# EAGLE design untitled (EAGLE 9.4.2)
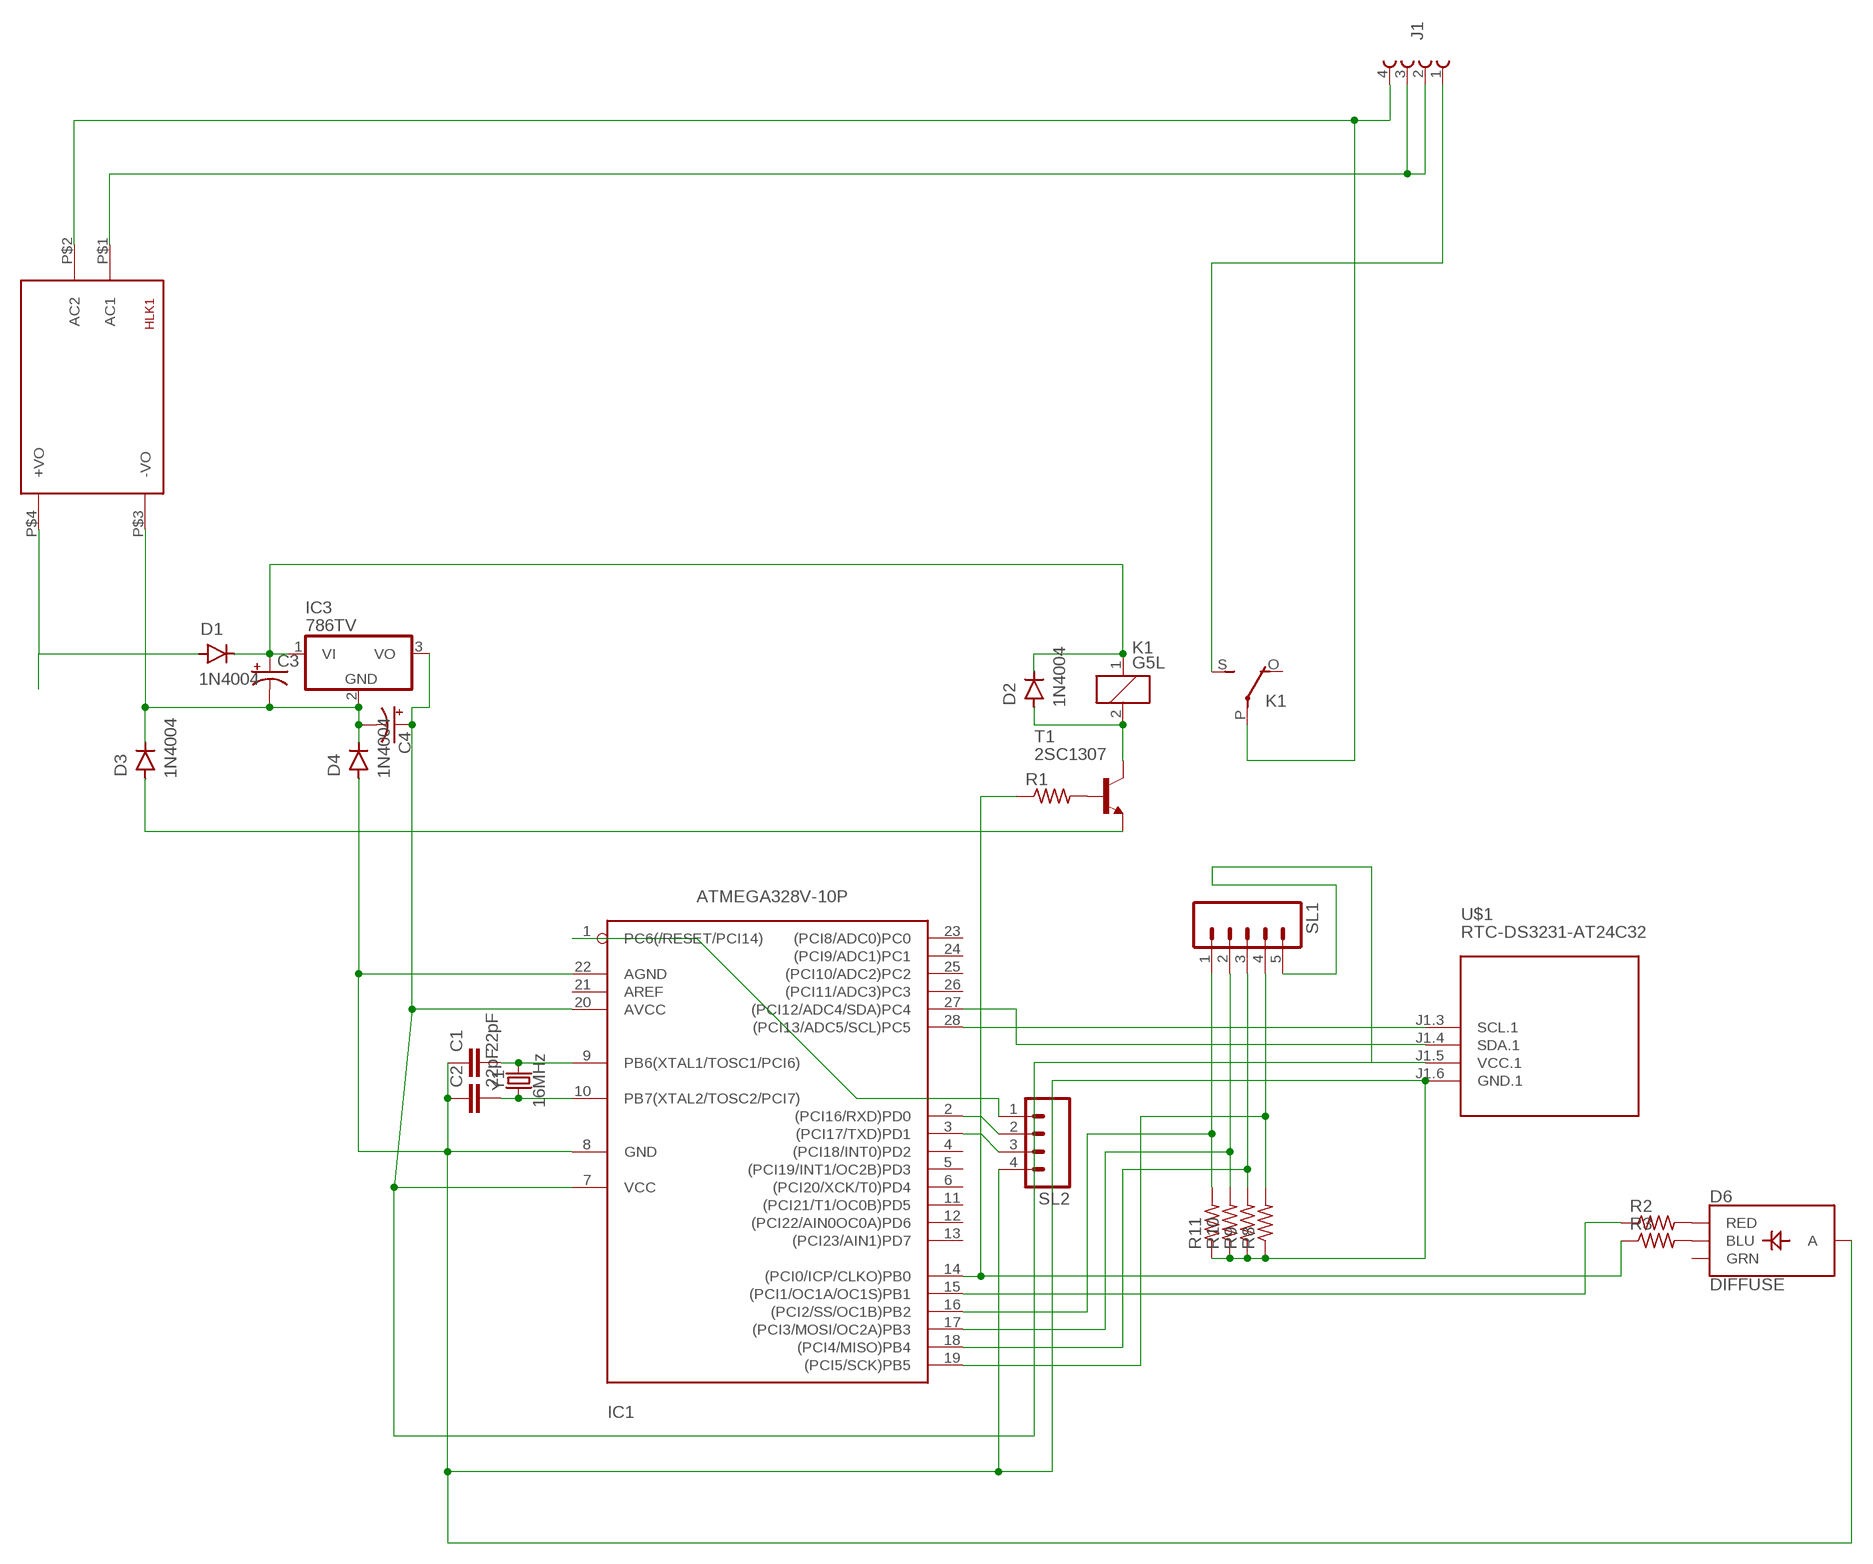
[diagram p0: schematic, sheet 1]

## Parts
C1  22pF  22PF-PTH-2.54MM-200V-5%  [CAP-PTH-2.54]
C2  22pF  22PF-PTH-2.54MM-200V-5%  [CAP-PTH-2.54]
C3  CPOL-USE2-4  [E2-4]
C4  CPOL-USE2-4  [E2-4]
D1  1N4004  [DO-41]
D2  1N4004  [DO-41]
D3  1N4004  [DO-41]
D4  1N4004  [DO-41]
D6  DIFFUSE  LED-RGB-CADIFFUSE  [LED-RGB-THRU]
HLK1  HLK-PM013W  [HLK-PM01]
IC1  ATMEGA328V-10P  [DIL28-3]
IC3  786TV  [TO220V]
J1  691213500004  [691213500004]
K1  G5L  [G5LE]
R1  R-US_0207/12  [0207/12]
R2  R-US_0207/12  [0207/12]
R3  R-US_0207/12  [0207/12]
R8  R-US_0207/12  [0207/12]
R9  R-US_0207/12  [0207/12]
R10  R-US_0207/12  [0207/12]
R11  R-US_0207/12  [0207/12]
SL1  M05  [05P]
SL2  M04  [04P]
T1  2SC1307  [TO220AV]
U$1  RTC-DS3231-AT24C32  [RTC-DS3231-AT24C32]
Y1  16MHz  CRYSTAL-16MHZPTH-HC49US  [HC49US]

## Nets
N$1: D1.A HLK1.P$4(+VO)
N$2: C3.- C4.- D3.C D4.C HLK1.P$3(-VO) IC3.2(GND)
N$3: C3.+ D1.C D2.C IC3.1(VI) K1.1
N$4: C1.2 IC1.9(PB6(XTAL1/TOSC1/PCI6)) Y1.2
N$5: C4.+ IC1.7(VCC) IC1.20(AVCC) IC3.3(VO) SL1.5 U$1.J1.5(VCC.1)
N$6: C2.2 IC1.10(PB7(XTAL2/TOSC2/PCI7)) Y1.1
N$7: IC1.19((PCI5/SCK)PB5) R8.2 SL1.4
N$8: D2.A K1.2 T1.2(C)
N$9: IC1.27((PCI12/ADC4/SDA)PC4) U$1.J1.4(SDA.1)
N$10: IC1.28((PCI13/ADC5/SCL)PC5) U$1.J1.3(SCL.1)
N$11: R1.2 T1.1(B)
N$12: D3.A T1.3(E)
N$13: IC1.14((PCI0/ICP/CLKO)PB0) R1.1 R3.1
N$14: HLK1.P$2(AC2) J1.4 K1.P(2:P)
N$15: HLK1.P$1(AC1) J1.2 J1.3
N$16: D6.1(RED) R2.2
N$17: D6.4(BLU) R3.2
N$18: J1.1 K1.S(2:S)
N$19: IC1.15((PCI1/OC1A/OC1S)PB1) R2.1
N$20: IC1.1(PC6(/RESET/PCI14)) SL2.1
N$21: C1.1 C2.1 D4.A D6.2(A) IC1.8(GND) IC1.22(AGND) R8.1 R9.1 R10.1 R11.1 SL2.4 U$1.J1.6(GND.1)
N$22: IC1.18((PCI4/MISO)PB4) R9.2 SL1.3
N$23: IC1.17((PCI3/MOSI/OC2A)PB3) R10.2 SL1.2
N$24: IC1.16((PCI2/SS/OC1B)PB2) R11.2 SL1.1
N$25: IC1.2((PCI16/RXD)PD0) SL2.2
N$26: IC1.3((PCI17/TXD)PD1) SL2.3
Unconnected: D6.3(GRN) IC1.4((PCI18/INT0)PD2) IC1.5((PCI19/INT1/OC2B)PD3) IC1.6((PCI20/XCK/T0)PD4) IC1.11((PCI21/T1/OC0B)PD5) IC1.12((PCI22/AIN0OC0A)PD6) IC1.13((PCI23/AIN1)PD7) IC1.21(AREF) IC1.23((PCI8/ADC0)PC0) IC1.24((PCI9/ADC1)PC1) IC1.25((PCI10/ADC2)PC2) IC1.26((PCI11/ADC3)PC3) K1.O(2:O)

## Library data of the parts
C1 C2 = SparkFun-Capacitors:22PF: 22pF ceramic capacitors A capacitor is a passive two-terminal electrical component used to store electrical energy temporarily in an electric field.; PROD_ID: CAP-09128
C3 C4 = adafruit:CPOL-US: POLARIZED CAPACITOR, American symbol
D1-D4 = Diodes:1N4004: DIODE GEN PURP 400V 1A DO41 Manufacturer's datasheet <https://www.mccsemi.com/pdf/Products/1N4001-1N4007(DO-41).pdf>; CREATED_BY: PCBLayout.com; DIGIKEY_PART_NUMBER: 1N4004MSCT-ND; MANUFACTURER: Micro Commercial Co; MPN: 1N4004; PACKAGE: DO-41
D6 = SparkFun-LED:LED-RGB-CA: LED-RGB Diffused Common Anode Packages: LED RGB-THRU P-LCC-4-3 LED-TRICOLOR-SMD SparkFun Products: RGB Diffused Common Anode- Diffuse <[https://www.sparkfun.com/products/10821]> RGB Diffused Common Anode - Clear <[https://www.sparkfun.com/products/10820]> Qduino Mini <[https://www.sparkfun.com/products/13614]> Triple Output LED RGB - SMD <https://www.sparkfun.com/products/7844>; PROD_ID: DIO-10632
HLK1 = HLK-PM01:HLK-PM01: Hi-Link Power Supply HLK-PM01 3W Author: Ahmed Said <https://github.com/AhmedSaid/EAGLELibraries>
IC1 = atmega328:ATMEGA328*P: MICROCONTROLLER 32 kBytes FLASH 2 kBytes SRAM 1 kBytes EEPROM USART 8-channel 10 bit ADC
IC3 = linear:78*: Positive VOLTAGE REGULATOR Source: http://cache.national.com/ds/LM/LM78L05.pdf http://www.fairchildsemi.com/ds/LM/LM7805.pdf
J1 = Wurth_Elektronik_Electromechanic_Terminal_Blocks_Connectors_rev19b:691213500004: SERIE 2135 - 5.08 MM - VERTICAL CABLE ENTRY WITH RISING CAGE CLAMP - WR-TBL =>ConTBL2 691213500004 Characteristics INSULATOR:PA6/66 FLAMABILITY RATING: UL94V0 COLOR: GREEN METAL HOUSING: COPPER ALLOY / Ni+Sn TERMINAL SCREW: STEEL / Zn WIRE GUARD: COPPER ALLOY / Ni+Sn OPERATING TEMPERATURE:-30°C UP TO +120°C COMPLIANCE: LEAD FREE AND ROHS ELECTRICAL UL VDE CURRENT RATING: 14A 14A WORKING VOLTAGE: 300VAC 250VAC WITHSTANDING VOLTAGE: 1,6KV 2KV CONTACT RESISTANCE: 20 mΩ MAX <http://katalog.we-online.de/media/images/v2/Family_WR-TBL_5_08_2135_VERTICAL_CABLE_ENTRY_W_RISING_CLAMP_6912135000XX.jpg> Details see: http://katalog.we-online.de/en/em/TBL_5_08_2135_VERTICAL_CABLE_ENTRY_W_RISING_CLAMP_6912135000XX 2015 (C) Wurth Elektronik
K1 = relay:G5L: RELAY 1 x switch, 10 A/120 V AC, 8 A/30 V ADC, Omron; OC_FARNELL: unknown; OC_NEWARK: unknown
R1-R3 R8-R11 = adafruit:R-US_: RESISTOR, American symbol
SL1 = con-amp-quick:M05: AMP QUICK CONNECTOR; OC_FARNELL: unknown; OC_NEWARK: unknown
SL2 = con-amp-quick:M04: AMP QUICK CONNECTOR; OC_FARNELL: unknown; OC_NEWARK: unknown
T1 = transistor-neu-to92:2SC1307: NPN Transistor Silicon Epitaxial, High Frequency Power Amplifier Source: 2SC1307.pdf
U$1 = diy-modules:RTC-DS3231-AT24C32: RTC Module with Battery and EEPROM based on DS3231 and AT24C32 chips Tutorial can be found here: https://edwardmallon.wordpress.com/2014/05/21/using-a-cheap-3-ds3231-rtc-at24c32-eeprom-from-ebay/ Click here to find device on ebay.com <http://www.ebay.com/sch/DS3231+AT24C32+module>
Y1 = SparkFun-Clocks:CRYSTAL-16MHZ: 16MHz Crystal Digikey Example <http://www.digikey.com/product-search/en?keywords=535-9122-1-ND> Frequency: 16MHz Frequency Stability: ±50ppm Frequency Tolerance: ±20ppm Load Capacitance: 18pF SparkFun Products: Pro Micro -5V/16MHz <https://www.sparkfun.com/products/12640> SparkFun Serial Enabled LCD Kit <https://www.sparkfun.com/products/10097>; PROD_ID: XTAL-08181; SF_ID: COM-00536

## Board
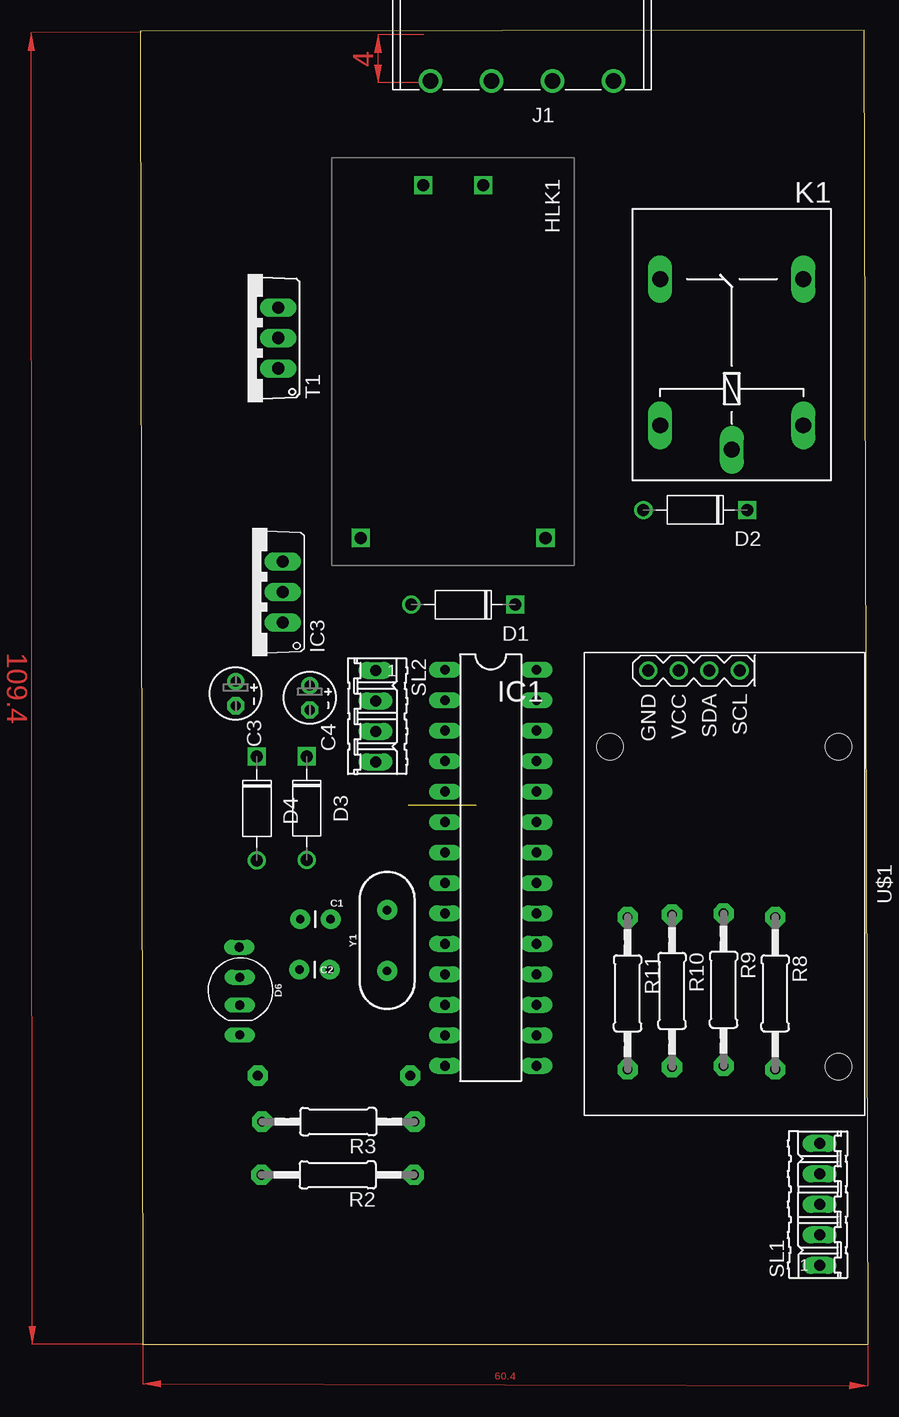
[diagram p1: board, top side]
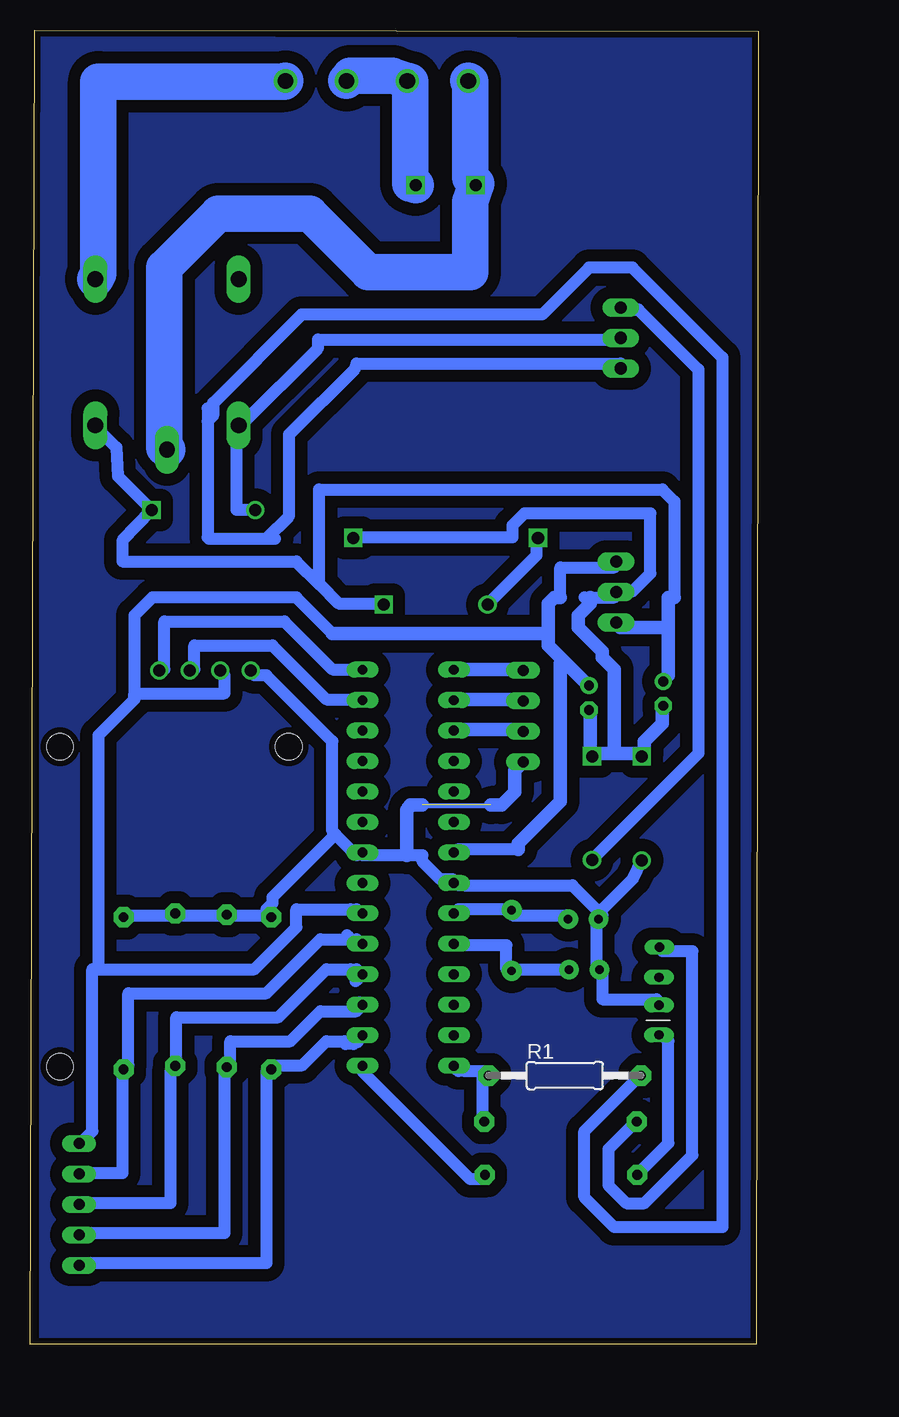
[diagram p2: board, bottom side, seen from below]

Size 60.66 x 109.56 mm. Coordinates in mm from the lower left corner, seen from the top.
Outline: 0.2,0 60.66,0 60.31,109.56 0,109.45 0.2,0
Copper layers (1*16): Top 0.035mm / dielectric 1.5mm / Bottom 0.035mm
Design rules "default *": minimum track width 45mil, minimum drill 0.35mm, track to track 40mil, track to pad 25mil, pad to pad 25mil, via to via 25mil, smd to smd 6mil, copper to edge 20mil, drill to drill 25mil, minimum pad ring 10mil, minimum via ring 8mil, stop-mask expansion 4mil, vias tented up to drill 0mil, thermal gap 10mil

### Footprints (pad centres in the part's own frame; a part is rotated, then mirrored left to right if it is on the bottom)
CAP-PTH-2.54 = drill 0.7 pad 1.651: 1 -1.27,0; 2 1.27,0
E2-4 = drill 0.813 pad 1.422: + -1.016,0 | drill 0.813 pad 1.422 octagon: - 1.016,0
DO-41 = drill 1: A 4.325,0 | drill 1 square: C -4.325,0
LED-RGB-THRU = drill 0.762 pad 0.889 long: 1 3.734,-0.051; 2 1.245,-0.051; 3 -1.067,-0.051; 4 -3.581,-0.102
HLK-PM01 = drill 1.016 square: P$1 -14.7,2.5; P$2 -14.7,-2.5; P$3 14.7,7.7; P$4 14.7,-7.7
DIL28-3 = drill 0.813 long: 1 -16.51,-3.81; 2 -13.97,-3.81; 3 -11.43,-3.81; 4 -8.89,-3.81; 5 -6.35,-3.81; 6 -3.81,-3.81; 7 -1.27,-3.81; 8 1.27,-3.81; 9 3.81,-3.81; 10 6.35,-3.81; 11 8.89,-3.81; 12 11.43,-3.81; 13 13.97,-3.81; 14 16.51,-3.81; 15 16.51,3.81; 16 13.97,3.81; 17 11.43,3.81; 18 8.89,3.81; 19 6.35,3.81; 20 3.81,3.81; 21 1.27,3.81; 22 -1.27,3.81; 23 -3.81,3.81; 24 -6.35,3.81; 25 -8.89,3.81; 26 -11.43,3.81; 27 -13.97,3.81; 28 -16.51,3.81
TO220V = drill 1.016 long: 1 -2.54,-2.54; 2 0,-2.54; 3 2.54,-2.54
691213500004 = drill 1.3: 1 -7.62,0; 2 -2.54,0; 3 2.54,0; 4 7.62,0
G5LE = drill 1.321 long: 1 -7.493,-5.969; 2 -7.493,5.969; O 4.699,5.969; P -9.525,0; S 4.699,-5.969
0207/12 = drill 0.813 pad 1.676 octagon: 1 -6.35,0; 2 6.35,0
05P = drill 0.914 long: 1 -5.08,0; 2 -2.54,0; 3 0,0; 4 2.54,0; 5 5.08,0
04P = drill 0.914 long: 1 -3.81,0; 2 -1.27,0; 3 1.27,0; 4 3.81,0
TO220AV = drill 1.016 long: 1 -2.54,-2.54; 2 0,-2.54; 3 2.54,-2.54
RTC-DS3231-AT24C32 = drill 1: J1.3 -17.78,1.27; J1.4 -17.78,-1.27; J1.5 -17.78,-3.81; J1.6 -17.78,-6.35 | hole 2.2: -11.43,-9.525; -11.43,9.525; 15.24,9.525
HC49US = drill 0.7 pad 1.651: 1 -2.54,0; 2 2.54,0

### Placement (x,y rotation side)
C1  14.59,35.44 0 top
C2  14.51,31.23 0 top
C3  7.94,54.24 270 top
C4  14.12,53.89 270 top
D1  26.9,61.65 180 top
D2  46.25,69.55 180 top
D3  13.87,44.69 270 top
D4  9.71,44.66 270 top
D6  8.34,29.51 270 top
HLK1  26.07,81.91 270 top
IC1  29.19,39.72 270 top
IC3  9.32,62.71 90 top
J1  31.8,105.31 180 top
K1  49.28,84.09 90 top
R1  16.14,22.39 0 bottom
R2  16.44,14.12 180 top
R3  16.49,18.55 180 top
R8  52.9,29.25 270 top
R9  48.6,29.55 270 top
R10  44.3,29.45 270 top
R11  40.6,29.25 270 top
SL1  56.6,11.65 90 top
SL2  19.6,52.35 270 top
T1  8.94,83.88 90 top
U$1  48.66,38.37 270 top
Y1  20.57,33.66 90 top

### Tracks (layer width: path | path; a pad name or v marks a point on that pad's centre or on a via)
A
  pour Bottom: 0.5,108.95 59.9,108.95 59.9,0.35 59.8,0.25 0.6,0.25 0.6,108.95
N$1
  Bottom 1.016: D1.A 22.5,61.75 18.5,65.75 18.5,66.75 HLK1.P$4
N$2
  Bottom 1.016: HLK1.P$3 33.5,67.25 20.5,67.25 20.5,68.25 19.5,69.25 9,69.25 9,64.25 10.5,62.75 11.5,62.75 IC3.2 12,62.25 14,62.25 14.5,62.25
  Bottom 1.143: C4.- 14,52.75 14,49.25 D3.C 13.5,49.25 12,49.25 | C3.- 8,52.75 8,51.75 9.5,50.25 9.5,49.25 D4.C 10,49.25 12,49.25 | 12,49.25 12,56.25 13,57.25 13,57.75 15,59.75 15,60.75 14,61.75 14,62.25
N$3
  Bottom 1.016: 36.6,63.35 38.5,65.25 53,65.25 53,66.99 D2.C 53.37,72.35 53.5,74.75 55,76.25 K1.1 | 36.6,63.35 35,61.75 31.5,61.75 D1.C | 36.6,63.35 36.6,71.25 8,71.25 7,70.25 7,62.25
  Bottom 1.143: 7.5,59.75 7.5,62.25 7,62.25 | 7.5,59.75 7.5,55.75 C3.+ | 7.5,59.75 11.5,59.75 IC3.1
N$4
  Bottom 1.016: IC1.9 25,36.25 21,36.25 Y1.2 20.5,35.75 16,35.75 C1.2
N$5
  Bottom 1.016: 33.5,36.25 IC1.20 34,36.25 38.5,36.25 38.5,34.75 42,31.25 55,31.25 | U$1.J1.5 44.5,55.75 44.5,54.25 52,54.25 | 20,41.25 25,41.25 IC1.7 | 16.5,62.25 16.5,64.75 12,64.75 IC3.3 | 52,54.25 52,60.75 50.5,62.25 38.5,62.25 35.5,59.25 | 55,31.25 55.5,31.25 55.5,17.75 56.5,16.75 SL1.5 | 55,31.25 55,50.75 52,53.75 52,54.25
  Bottom 1.143: 16.25,57 17.5,58.25 17.5,59.25 | 16.25,57 14.5,55.25 C4.+ | 17.5,59.25 17.5,61.75 17,62.25 16.5,62.25 | 20,41.25 20,41.75 16.5,45.25 16.5,56.75 16.25,57 | 35.5,59.25 17.5,59.25
N$6
  Bottom 1.016: IC1.10 25,33.25 21,33.25 21,31.25 Y1.1 20.5,31.25 16,31.25 C2.2
N$7
  Bottom 1.016: 33.5,33.75 IC1.19 34,33.75 | 34.28,34.09 34,33.75 | 34,33.75 36.5,33.75 41,29.25 52.5,29.25 52.5,23.25 R8.2 53,22.75 53,14.25 56.5,14.25 SL1.4
N$8
  Bottom 1.016: D2.A 43.5,69.55 43.5,76.25 K1.2 43,76.75 36.7,83.05 36.7,83.75 11.5,83.75 T1.2
N$9
  Bottom 1.016: IC1.27 33.5,53.75 36,53.75 40.5,58.25 47,58.25 47,56.25 U$1.J1.4
N$10
  Bottom 1.016: IC1.28 33.5,56.25 35.5,56.25 39.5,60.25 49.5,60.25 49.5,56.25 U$1.J1.3
N$11
  Bottom 1.016: 45.9,78.02 45.9,76.95 | 45.9,76.95 45.9,67.25 45.8,67.15 41,67.15 | 41,67.15 40.28,67.15 | 41,67.15 39.1,69.05 39.1,75.85 33.61,81.34 33.5,81.75 11.5,81.75 T1.1 | R1.2 10,22.25 14.5,17.75 14.5,12.25 12,9.75 3,9.75 3,82.25 10.5,89.75 14.1,89.75 18.02,85.83 38.09,85.83 45.45,78.47 45.45,77.41 45.9,76.95
N$12
  Bottom 1.016: D3.A 13.5,40.75 5,49.25 5,81.25 10,86.25 11,86.25 T1.3
N$13
  Bottom 1.016: 25,22.75 IC1.14 24.5,22.75 22.5,22.75 R1.1 23,22.25 23,18.75 R3.1
N$14
  Bottom 3.048: J1.4 24,105.25 24,97.25 23.5,96.75 HLK1.P$2 24,95.25 24,89.35 32.5,89.35 37.4,94.25 45,94.25 49.5,89.75 49.5,74.75 K1.P
N$15
  Bottom 3.048: HLK1.P$1 29,96.75 29,105.25 J1.3 30.5,105.75 34,105.75 J1.2
N$16
  Bottom 1.016: D6.1 8,25.75 7.5,25.25 7.5,16.75 10,14.25 R2.2
N$17
  Bottom 1.016: D6.4 8,32.75 5.5,32.75 5.5,15.75 9.5,11.75 11,11.75 12.5,13.25 12.5,16.25 10.5,18.25 R3.2
N$18
  Bottom 3.048: J1.1 39.5,105.25 55,105.25 55,89.25 K1.S
N$19
  Bottom 1.016: IC1.15 33,22.75 24,13.75 22.82,13.75 R2.1
N$20
  Bottom 1.143: IC1.1 25,56.25 20,56.25 SL2.1
N$21  (1 unrouted)
  Bottom 1.016: 25,38.25 IC1.8 | IC1.8 25.5,38.75 26.5,38.75 28,40.25 28,40.75 29.3,40.75 33,40.75 IC1.22 33.5,40.75 35.25,42.5 | 35.25,42.5 35.5,42.75 35.5,50.25 41,55.75 42,55.75 U$1.J1.6 | R8.1 52.5,35.75 49,35.75 R9.1 48.5,35.75 44.5,35.75 R10.1 44,35.75 41,35.75 R11.1 41,36.25 40.5,36.75 40.5,37.25 35.25,42.5 | D6.2 8.5,28.75 13,28.75 13,30.75 C2.1 13.5,31.25 13.5,35.25 C1.1 | D4.A 10.44,38.81 13,36.25 13,35.75 C1.1 | C1.1 13.5,36.25 15.5,38.25 24.5,38.25 IC1.8
  Bottom 1.143: SL2.4 20.3,47.84 20.3,46.05 21.4,44.95 22.3,44.95 | 29.3,40.75 29.3,44.55 29.2,44.65 29.2,44.75 29,44.95 28,44.95
N$22
  Bottom 1.016: 33.5,31.25 IC1.18 | IC1.18 34,31.25 36,31.25 40,27.25 48.5,27.25 48.5,23.25 R9.2 49,22.75 49,11.75 56.5,11.75 SL1.3 | IC1.18 33.58,30.26
N$23
  Bottom 1.016: 33.25,28.5 IC1.17 | 33.39,27.86 IC1.17 | IC1.17 33.5,27.75 36.5,27.75 39,25.25 44,25.25 44,23.25 R10.2 44.5,22.75 44.5,9.25 56.5,9.25 SL1.2
N$24
  Bottom 1.016: 34.41,25.01 33.74,25.01 IC1.16 33.39,25.2 34.28,25.2 34.5,25.25 36,25.25 38,23.25 40.5,23.25 R11.2 41,22.75 41,6.75 56.5,6.75 SL1.1
N$25
  Bottom 1.143: IC1.2 25,53.75 20,53.75 SL2.2
N$26
  Bottom 1.143: IC1.3 25,51.25 20,51.25 SL2.3
N$27
  Bottom 0.406: 22.7,44.85 27.8,44.85 27.9,44.75 28.2,45.05
(copper drawn outside any net)
  shapes: Top area x3